# EAGLE board board_Nutzen (EAGLE 8.7.0)
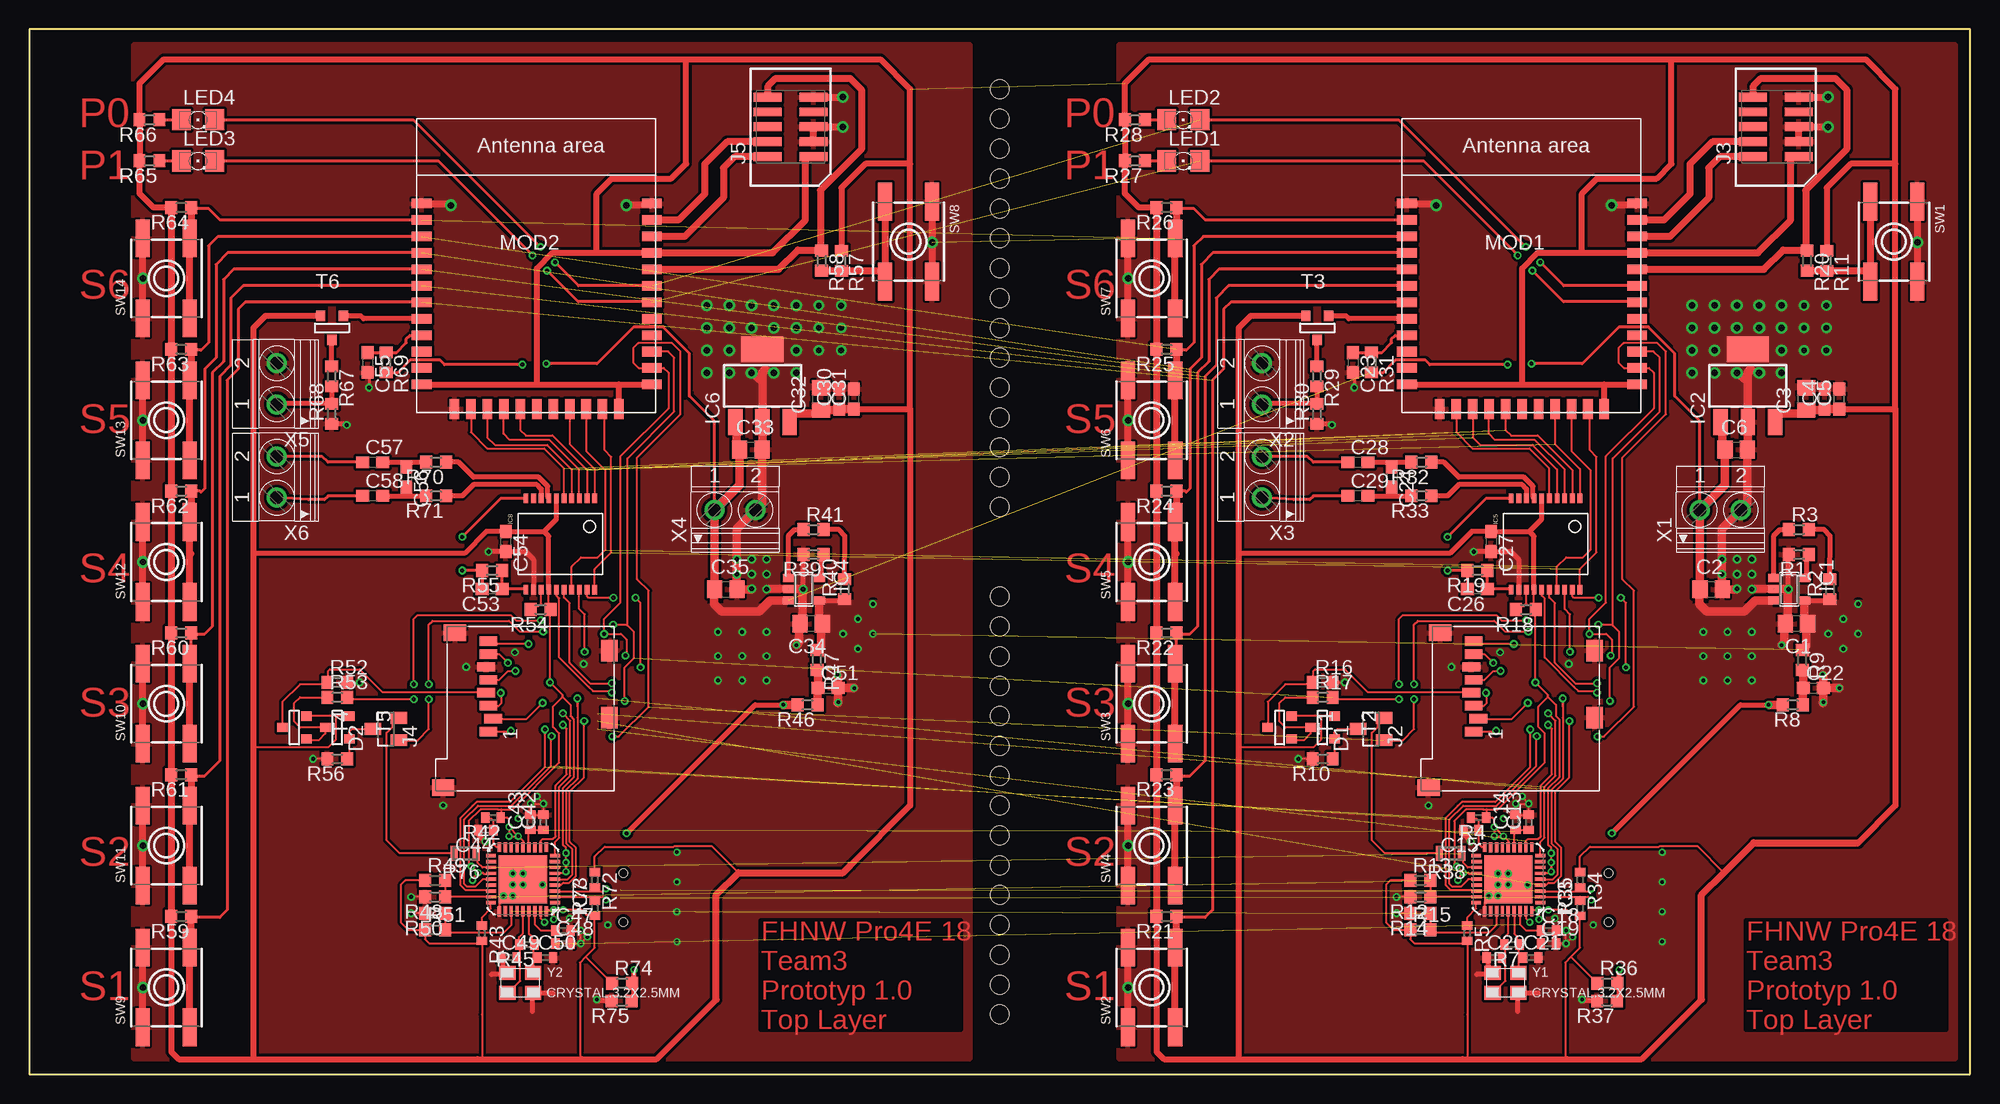
[diagram p6: board, top side]
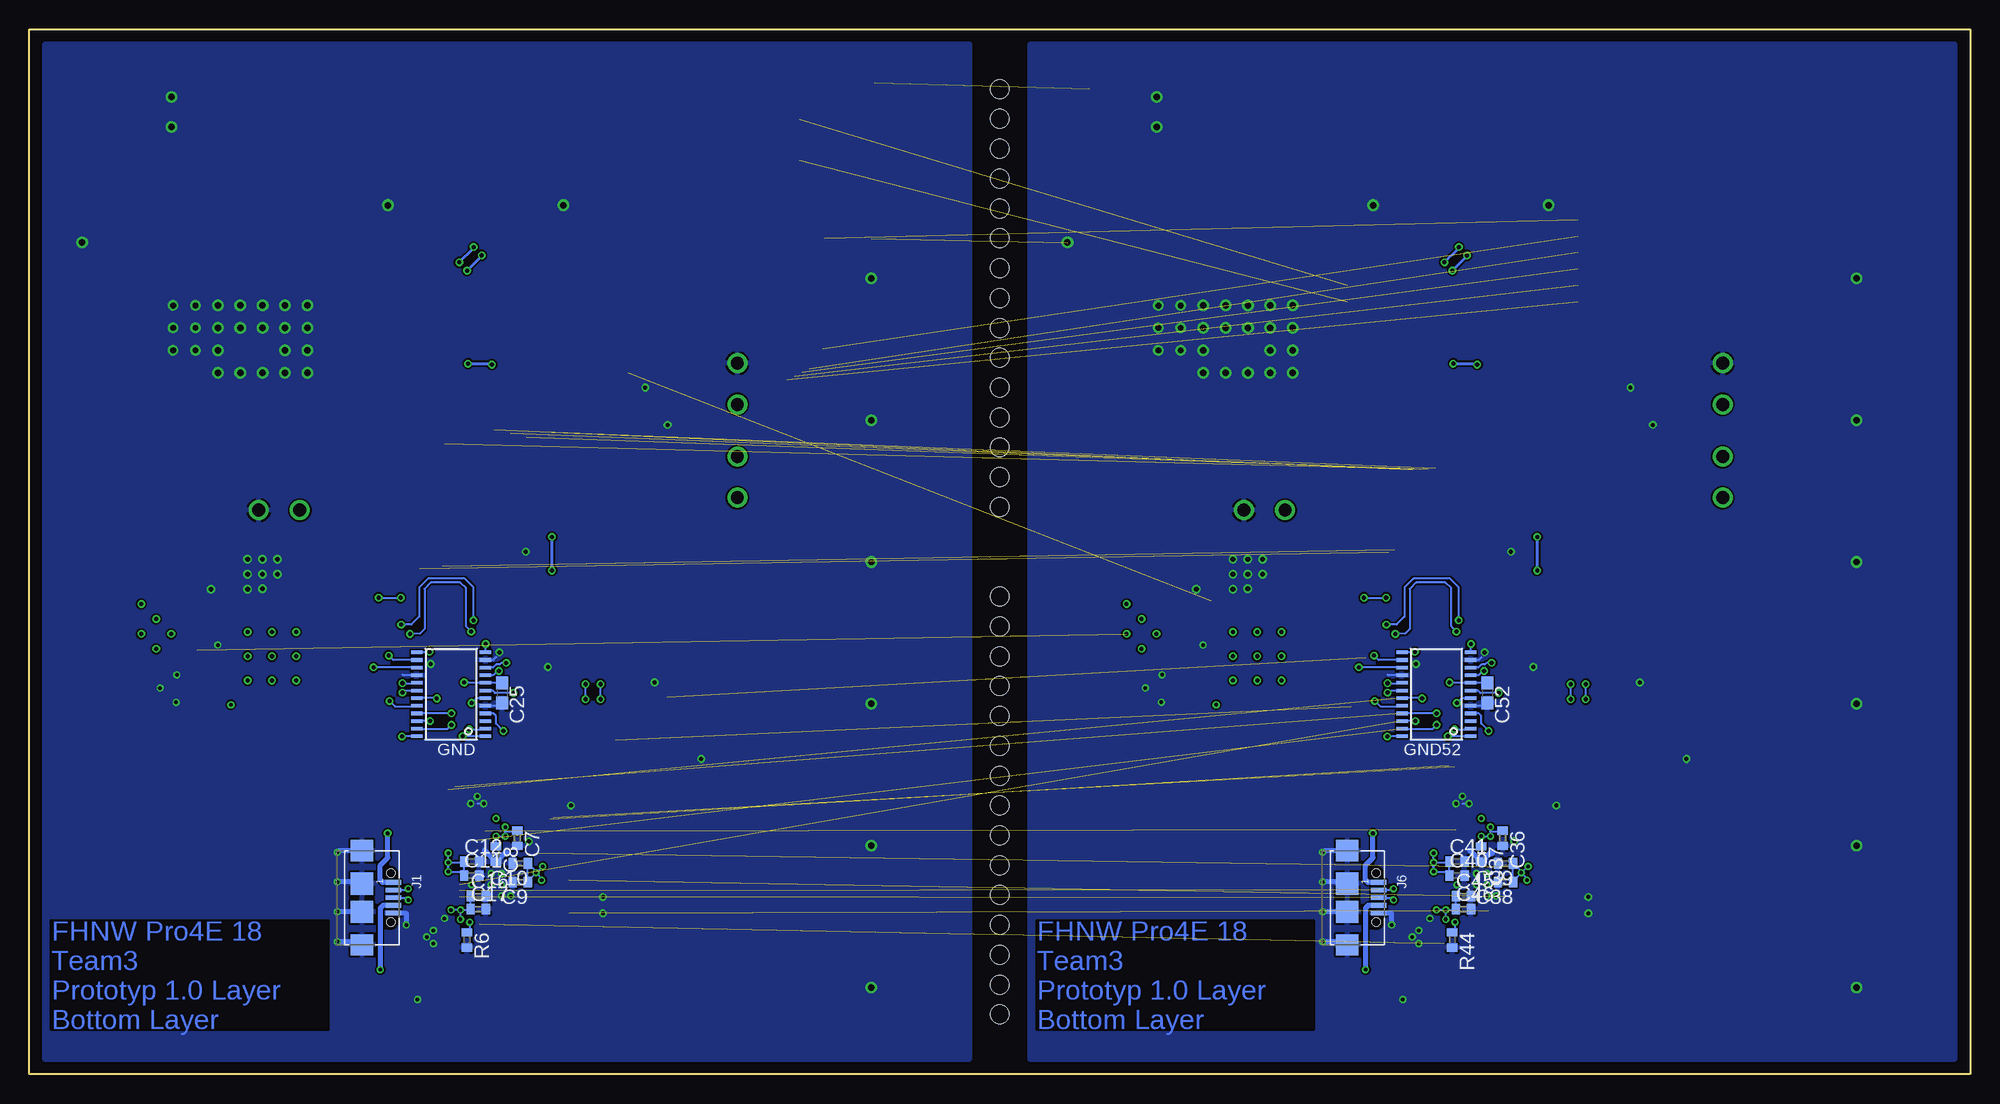
[diagram p7: board, bottom side, seen from below]

Size 165.1 x 88.9 mm. Coordinates in mm from the lower left corner, seen from the top.
Outline: 0,0 165.1,0 165.1,88.9 0,88.9 0,0
Copper layers (1*16): Top 0.035mm / dielectric 1.5mm / Bottom 0.035mm
Design rules "PCB-POOL Standard": minimum track width 0.15mm, minimum drill 0.3mm, track to track 0.15mm, track to pad 0.15mm, pad to pad 0.15mm, via to via 0.15mm, smd to smd 0.15mm, copper to edge 0.3mm, drill to drill 0.2mm, minimum pad ring 0.2mm, minimum via ring 0.15mm, stop-mask expansion 0.075mm, vias tented up to drill 0mil, thermal gap 0.2mm
Holes 1.6 mm at 82.55,5.08 82.55,7.62 82.55,10.16 82.55,12.7 82.55,15.24 82.55,17.78 82.55,20.32 82.55,22.86 82.55,25.4 82.55,27.94 82.55,30.48 82.55,33.02 82.55,35.56 82.55,38.1 82.55,40.64 82.55,50.8 82.55,53.34 82.55,55.88 82.55,58.42 82.55,60.96 82.55,63.5 82.55,66.04 82.55,68.58 82.55,71.12 82.55,73.66 82.55,76.2 82.55,78.74 82.55,81.28 82.55,83.82 82.55,48.26

## Footprints (pad centres in the part's own frame; a part is rotated, then mirrored left to right if it is on the bottom)
C0805 = smd 1.3 x 1.5: 1 -0.95,0; 2 0.95,0
C0603 = smd 1.1 x 1: 1 -0.85,0; 2 0.85,0
C0402 = smd 0.7 x 0.9: 1 -0.65,0; 2 0.65,0
SOT23 = smd 1 x 1.4: 1 -0.95,-1.1; 2 0.95,-1.1; 3 0,1.1
TSSOP24 = smd 0.305 x 0.991: 1 -3.575,-2.918; 2 -2.925,-2.918; 3 -2.275,-2.918; 4 -1.625,-2.918; 5 -0.975,-2.918; 6 -0.325,-2.918; 7 0.325,-2.918; 8 0.975,-2.918; 9 1.625,-2.918; 10 2.275,-2.918; 11 2.925,-2.918; 12 3.575,-2.918; 13 3.575,2.918; 14 2.925,2.918; 15 2.275,2.918; 16 1.625,2.918; 17 0.975,2.918; 18 0.325,2.918; 19 -0.325,2.918; 20 -0.975,2.918; 21 -1.625,2.918; 22 -2.275,2.918; 23 -2.925,2.918; 24 -3.575,2.918
SOT23-5 = smd 0.69 x 0.99: 1 -0.95,-1.29; 2 0,-1.29; 3 0.95,-1.29; 4 0.95,1.3; 5 -0.95,1.3
SOT223 = smd 1.219 x 2.235: 1 -2.311,-3.099; 2 0,-3.099; 3 2.311,-3.099 | smd 3.6 x 2.2: 4 0,3.099
QFN36-6X6 = smd 0.28 x 0.84: 1 -2,-2.735; 9 2,-2.735; 19 2,2.735; 27 -2,2.735 | smd 0.28 x 0.89: 2 -1.5,-2.71; 3 -1,-2.71; 4 -0.5,-2.71; 5 0,-2.71; 6 0.5,-2.71; 7 1,-2.71; 8 1.5,-2.71; 20 1.5,2.71; 21 1,2.71; 22 0.5,2.71; 23 0,2.71; 24 -0.5,2.71; 25 -1,2.71; 26 -1.5,2.71 | smd 0.84 x 0.28: 10 2.735,-2; 18 2.735,2; 28 -2.735,2; 36 -2.735,-2 | smd 0.89 x 0.28: 11 2.71,-1.5; 12 2.71,-1; 13 2.71,-0.5; 14 2.71,0; 15 2.71,0.5; 16 2.71,1; 17 2.71,1.5; 29 -2.71,1.5; 30 -2.71,1; 31 -2.71,0.5; 32 -2.71,0; 33 -2.71,-0.5; 34 -2.71,-1; 35 -2.71,-1.5 | smd 4.1 x 4.1: EXP 0,0
SSOP_20 = smd 0.813 x 0.406: 1 -3.9,2.925; 2 -3.9,2.275; 3 -3.9,1.625; 4 -3.9,0.975; 5 -3.9,0.325; 6 -3.9,-0.325; 7 -3.9,-0.975; 8 -3.9,-1.625; 9 -3.9,-2.275; 10 -3.9,-2.925; 11 3.9,-2.925; 12 3.9,-2.275; 13 3.9,-1.625; 14 3.9,-0.975; 15 3.9,-0.325; 16 3.9,0.325; 17 3.9,0.975; 18 3.9,1.625; 19 3.9,2.275; 20 3.9,2.925
629105136821 = smd 0.4 x 1.35: 1 -1.3,2.675; 2 -0.65,2.675; 3 0,2.675; 4 0.65,2.675; 5 1.3,2.675 | smd 1.8 x 1.9: SHELL -4,0; SHELL3 4,0 | smd 1.9 x 1.9: SHELL1 -1.2,0; SHELL2 1.2,0 | hole 0.7: -2.075,2.45; 2.075,2.45
693071010811 = smd 0.8 x 1.5: 1 0,0; 2 1.1,-0.4; 3 2.2,0; 4 3.3,0.2; 5 4.4,0; 6 5.5,0.2; 7 6.6,0; 8 7.7,0 | smd 1.4 x 1.9: 9 -4.75,3.85; 9-1 8.4,2.85 | smd 1.8 x 1.4: 10 1.19,-10.3; 10-1 6.89,-10.3
HDRV127P5X2-10_N = smd 0.76 x 2.4: 1 -2.54,-1.95; 2 -2.54,1.95; 3 -1.27,-1.95; 4 -1.27,1.95; 5 0,-1.95; 6 0,1.95; 7 1.27,-1.95; 8 1.27,1.95; 9 2.54,-1.95; 10 2.54,1.95
LED_1206 = smd 1.6 x 1.803: A -1.422,0; C 1.422,0
ACONNO_ACM_52832 = smd 1.676 x 0.813: 1 -9.8,8.4; 2 -9.8,7; 3 -9.8,5.6; 4 -9.8,4.2; 5 -9.8,2.8; 6 -9.8,1.4; 7 -9.8,0; 8 -9.8,-1.4; 9 -9.8,-2.8; 10 -9.8,-4.2; 11 -9.8,-5.6; 12 -9.8,-7; 24 9.8,-7; 25 9.8,-5.6; 26 9.8,-4.2; 27 9.8,-2.8; 28 9.8,-1.4; 29 9.8,0; 30 9.8,1.4; 31 9.8,2.8; 32 9.8,4.2; 33 9.8,5.6; 34 9.8,7; 35 9.8,8.4 | smd 0.813 x 1.676: 13 -7,-9.1; 14 -5.6,-9.1; 15 -4.2,-9.1; 16 -2.8,-9.1; 17 -1.4,-9.1; 18 0,-9.1; 19 1.4,-9.1; 20 2.8,-9.1; 21 4.2,-9.1; 22 5.6,-9.1; 23 7,-9.1
R0603 = smd 1 x 1.1: 1 -0.85,0; 2 0.85,0
R0402 = smd 0.7 x 0.9: 1 -0.65,0; 2 0.65,0
MINI_MELF-0102W = smd 0.6 x 1.3: 1 -0.95,0; 2 0.95,0
EVQ-Q2 = smd 3.2 x 1.2: A -3.4,-2; A' 3.4,-2; B -3.4,2; B' 3.4,2
SOT-23 = smd 0.787 x 0.889: 1 0.025,-1.016; 2 -0.94,1.016; 3 0.991,1.016
1751248 = drill 1.1 pad 1.7: 1 -1.75,-0.1; 2 1.75,-0.1
3.2X2.5MM = smd 1.4 x 1.2: 1 -1.1,-0.85; 2 1.1,-0.85; 3 1.1,0.85; 4 -1.1,0.85

## Placement (x,y rotation side)
C1  10u  [C0805]  150.33,38.32 180 top
C2  10u  [C0805]  143.07,41.26 0 top
C3  10u  [C0805]  151.16,57.46 90 top
C4  1u  [C0603]  152.72,57.46 90 top
C5  100n  [C0603]  153.96,57.46 90 top
C6  10u  [C0805]  145.19,53.14 0 top
C7  100n  [C0402]  123.59,20.08 270 bottom
C8  1n  [C0402]  125.41,18.73 270 bottom
C9  100n  [C0402]  123.35,16.35 180 bottom
C10  1n  [C0402]  123.35,17.94 180 bottom
C11  100n  [C0402]  127.48,16.91 0 bottom
C12  1n  [C0402]  127.48,18.1 0 bottom
C13  1u  [C0402]  127.56,21.43 90 top
C14  100n  [C0402]  126.44,21.43 90 top
C15  100n  [C0402]  122.63,20.76 180 top
C16  100n  [C0402]  126.92,15.16 0 bottom
C17  1n  [C0402]  126.92,14.05 0 bottom
C18  1u  [C0402]  129.22,12.22 0 top
C19  100n  [C0402]  129.22,11.11 0 top
C20  8p  [C0402]  124.62,9.92 0 top
C21  8p  [C0402]  127.71,9.92 0 top
C22  100n  [C0603]  151.76,32.86 0 top
C23  1u  [C0603]  112.6,60.57 270 top
C24  NP  [C0603]  115.89,50.8 270 top
C25  100n  [C0603]  124.89,32.43 270 bottom
C26  1n  [C0603]  123.19,41.27 180 top
C27  100n  [C0603]  124.35,45.33 270 top
C28  0R  [C0603]  113.03,52.07 0 top
C29  0R  [C0603]  113.03,49.21 0 top
C30  1u  [C0603]  68.9,57.46 90 top
C31  100n  [C0603]  70.14,57.46 90 top
C32  10u  [C0805]  67.34,57.46 90 top
C33  10u  [C0805]  61.37,53.14 0 top
C34  10u  [C0805]  66.51,38.32 180 top
C35  10u  [C0805]  59.25,41.26 0 top
C36  100n  [C0402]  39.77,20.08 270 bottom
C37  1n  [C0402]  41.59,18.73 270 bottom
C38  100n  [C0402]  39.53,16.35 180 bottom
C39  1n  [C0402]  39.53,17.94 180 bottom
C40  100n  [C0402]  43.66,16.91 0 bottom
C41  1n  [C0402]  43.66,18.1 0 bottom
C42  1u  [C0402]  43.74,21.43 90 top
C43  100n  [C0402]  42.62,21.43 90 top
C44  100n  [C0402]  38.81,20.76 180 top
C45  100n  [C0402]  43.1,15.16 0 bottom
C46  1n  [C0402]  43.1,14.05 0 bottom
C47  1u  [C0402]  45.4,12.22 0 top
C48  100n  [C0402]  45.4,11.11 0 top
C49  8p  [C0402]  40.8,9.92 0 top
C50  8p  [C0402]  43.89,9.92 0 top
C51  100n  [C0603]  67.94,32.86 0 top
C52  100n  [C0603]  41.07,32.43 270 bottom
C53  1n  [C0603]  39.37,41.27 180 top
C54  100n  [C0603]  40.53,45.33 270 top
C55  1u  [C0603]  28.78,60.57 270 top
C56  NP  [C0603]  32.07,50.8 270 top
C57  0R  [C0603]  29.21,52.07 0 top
C58  0R  [C0603]  29.21,49.21 0 top
D1  BAS40-05  [SOT23]  114.14,29.37 90 top
D2  BAS40-05  [SOT23]  30.32,29.37 90 top
GND  TS3A27  [TSSOP24]  129.22,32.32 90 bottom
GND52  TS3A27  [TSSOP24]  45.4,32.32 90 bottom
IC1  MCP73831  [SOT23-5]  149.71,41.27 270 top
IC2  LT1963EST-1.5  [SOT223]  146.18,58.58 0 top
IC3  VUB300  [QFN36-6X6]  125.81,16.59 90 top
IC4  MCP73831  [SOT23-5]  65.89,41.27 270 top
IC5  WTV020SD-20S  [SSOP_20]  128.98,45.1 270 top
IC6  LT1963EST-1.5  [SOT223]  62.36,58.58 0 top
IC7  VUB300  [QFN36-6X6]  41.99,16.59 90 top
IC8  WTV020SD-20S  [SSOP_20]  45.16,45.1 270 top
J1  [629105136821]  136.81,15.02 270 bottom
J2  [693071010811]  122.87,29.15 90 top
J3  DEBUG_CONNECTOR  [HDRV127P5X2-10_N]  148.57,80.61 90 top
J4  [693071010811]  39.05,29.15 90 top
J5  DEBUG_CONNECTOR  [HDRV127P5X2-10_N]  64.75,80.61 90 top
J6  [629105136821]  52.99,15.02 270 bottom
LED1  [LED_1206]  98.17,77.71 0 top
LED2  [LED_1206]  98.17,81.2 0 top
LED3  [LED_1206]  14.35,77.71 0 top
LED4  [LED_1206]  14.35,81.2 0 top
MOD1  ACM_52832_VER2  [ACONNO_ACM_52832]  126.98,65.68 0 top
MOD2  ACM_52832_VER2  [ACONNO_ACM_52832]  43.16,65.68 0 top
R1  2k  [R0603]  150.53,44.22 180 top
R2  NP  [R0603]  153.18,41.26 90 top
R3  NP  [R0603]  150.53,46.33 0 top
R4  100k  [R0402]  123.27,21.83 180 top
R5  NP  [R0402]  122.32,11.99 270 top
R6  12k  [R0402]  127.87,11.43 270 bottom
R7  1M  [R0402]  126.13,11.03 180 top
R8  Ferit Bead  [R0603]  150.02,31.43 180 top
R9  Ferit Bead  [R0603]  150.81,35.24 270 top
R10  470k  [R0603]  110.01,26.83 180 top
R11  10k  [R0603]  152.9,69.2 270 top
R12  1k  [R0603]  118.33,15.08 180 top
R13  NP  [R0603]  118.33,16.48 0 top
R14  1k  [R0603]  118.33,13.68 180 top
R15  NP  [R0603]  118.33,12.29 0 top
R16  470k  [R0603]  110.01,33.34 0 top
R17  470k  [R0603]  110.01,32.07 0 top
R18  150  [R0603]  127.32,39.53 180 top
R19  15k  [R0603]  123.19,42.86 180 top
R20  330R  [R0603]  151.23,69.22 270 top
R21  10k  [R0603]  96.74,13.42 180 top
R22  10k  [R0603]  96.74,37.55 180 top
R23  10k  [R0603]  96.74,25.48 180 top
R24  10k  [R0603]  96.74,49.61 180 top
R25  10k  [R0603]  96.74,61.68 180 top
R26  10k  [R0603]  96.74,73.74 180 top
R27  1k  [R0603]  94.04,77.71 180 top
R28  1k  [R0603]  94.04,81.2 180 top
R29  0R  [R0603]  109.54,59.37 270 top
R30  NP  [R0603]  109.54,56.2 90 top
R31  1k  [R0603]  114.19,60.57 270 top
R32  0R  [R0603]  118.43,52.07 180 top
R33  0R  [R0603]  118.43,49.21 180 top
R34  15k  [R0402]  131.92,16.54 270 top
R35  15k  [R0402]  131.92,14.13 90 top
R36  NP  [R0603]  134.24,7.75 0 top
R37  1k  [R0603]  134.21,6.22 180 top
R38  0R  [MINI_MELF-0102W]  120.89,18.8 180 top
R39  2k  [R0603]  66.71,44.22 180 top
R40  NP  [R0603]  69.36,41.26 90 top
R41  NP  [R0603]  66.71,46.33 0 top
R42  100k  [R0402]  39.45,21.83 180 top
R43  NP  [R0402]  38.5,11.99 270 top
R44  12k  [R0402]  44.05,11.43 270 bottom
R45  1M  [R0402]  42.31,11.03 180 top
R46  Ferit Bead  [R0603]  66.2,31.43 180 top
R47  Ferit Bead  [R0603]  66.99,35.24 270 top
R48  1k  [R0603]  34.51,15.08 180 top
R49  NP  [R0603]  34.51,16.48 0 top
R50  1k  [R0603]  34.51,13.68 180 top
R51  NP  [R0603]  34.51,12.29 0 top
R52  470k  [R0603]  26.19,33.34 0 top
R53  470k  [R0603]  26.19,32.07 0 top
R54  150  [R0603]  43.5,39.53 180 top
R55  15k  [R0603]  39.37,42.86 180 top
R56  470k  [R0603]  26.19,26.83 180 top
R57  10k  [R0603]  69.08,69.2 270 top
R58  330R  [R0603]  67.41,69.22 270 top
R59  10k  [R0603]  12.92,13.42 180 top
R60  10k  [R0603]  12.92,37.55 180 top
R61  10k  [R0603]  12.92,25.48 180 top
R62  10k  [R0603]  12.92,49.61 180 top
R63  10k  [R0603]  12.92,61.68 180 top
R64  10k  [R0603]  12.92,73.74 180 top
R65  1k  [R0603]  10.22,77.71 180 top
R66  1k  [R0603]  10.22,81.2 180 top
R67  0R  [R0603]  25.72,59.37 270 top
R68  NP  [R0603]  25.72,56.2 90 top
R69  1k  [R0603]  30.37,60.57 270 top
R70  0R  [R0603]  34.61,52.07 180 top
R71  0R  [R0603]  34.61,49.21 180 top
R72  15k  [R0402]  48.1,16.54 270 top
R73  15k  [R0402]  48.1,14.13 90 top
R74  NP  [R0603]  50.42,7.75 0 top
R75  1k  [R0603]  50.39,6.22 180 top
R76  0R  [MINI_MELF-0102W]  37.07,18.8 180 top
SW1  SW_TACT_SMD  [EVQ-Q2]  158.61,70.84 270 top
SW2  SW_TACT_SMD  [EVQ-Q2]  95.47,7.39 90 top
SW3  SW_TACT_SMD  [EVQ-Q2]  95.47,31.52 90 top
SW4  SW_TACT_SMD  [EVQ-Q2]  95.47,19.45 90 top
SW5  SW_TACT_SMD  [EVQ-Q2]  95.47,43.58 90 top
SW6  SW_TACT_SMD  [EVQ-Q2]  95.47,55.65 90 top
SW7  SW_TACT_SMD  [EVQ-Q2]  95.47,67.71 90 top
SW8  SW_TACT_SMD  [EVQ-Q2]  74.79,70.84 270 top
SW9  SW_TACT_SMD  [EVQ-Q2]  11.65,7.39 90 top
SW10  SW_TACT_SMD  [EVQ-Q2]  11.65,31.52 90 top
SW11  SW_TACT_SMD  [EVQ-Q2]  11.65,19.45 90 top
SW12  SW_TACT_SMD  [EVQ-Q2]  11.65,43.58 90 top
SW13  SW_TACT_SMD  [EVQ-Q2]  11.65,55.65 90 top
SW14  SW_TACT_SMD  [EVQ-Q2]  11.65,67.71 90 top
T1  [SOT-23]  106.36,29.53 270 top
T2  [SOT-23]  110.01,29.53 270 top
T3  [SOT-23]  109.54,63.5 0 top
T4  [SOT-23]  22.54,29.53 270 top
T5  [SOT-23]  26.19,29.53 270 top
T6  [SOT-23]  25.72,63.5 0 top
X1  1751248  [1751248]  143.84,48.09 0 top
X2  1751248  [1751248]  104.78,58.74 90 top
X3  1751248  [1751248]  104.78,50.8 90 top
X4  1751248  [1751248]  60.02,48.09 0 top
X5  1751248  [1751248]  20.95,58.74 90 top
X6  1751248  [1751248]  20.95,50.8 90 top
Y1  CRYSTAL.3.2X2.5MM  [3.2X2.5MM]  125.57,7.78 0 top
Y2  CRYSTAL.3.2X2.5MM  [3.2X2.5MM]  41.75,7.78 0 top

## Tracks (layer width: path | path; a pad name or v marks a point on that pad's centre or on a via)
+3V3  (via drill 0.3, 0.35)  (1 unrouted)
  Top 0.15: R5.2 122.32,11.14 122.32,5.08 | 130.78,13.97 v129.22,13.97 | v121.42,17.68 121.21,17.89 121.21,21.51 | 123.67,22.54 122.4,22.54 | 123.75,22 R4.1 | R43.2 38.5,11.14 38.5,5.08 | 46.96,13.97 v45.4,13.97 | v37.6,17.68 37.39,17.89 37.39,21.51 | 39.85,22.54 38.58,22.54 | 39.93,22 R42.1
  Top 0.152: v129.22,13.97 v128.43,13.97 | v128.43,13.97 v128.43,13.18 | IC3.36 127.81,13.97 v128.43,13.97 | v129.46,17.22 v129.46,18.81 129.46,19.26 129.19,19.53 129.19,24.32 130.14,25.26 130.14,30.2 129.86,30.47 129.86,31.43 129.19,32.1 | v129.46,18.02 v129.46,17.22 | v129.46,17.22 129.33,17.09 IC3.6 | v124.62,21.03 v125.41,20.24 | v125.41,20.24 v124.62,20.24 v124.62,21.03 | v125.41,20.24 125.81,19.84 IC3.14 | v122,17.14 121.52,16.67 v121.52,16.51 | v121.42,17.68 v121.42,17.67 v122,17.14 | v122,17.14 122.4,17.14 122.48,17.07 123.08,17.07 IC3.22 | v124.62,21.03 124.62,21.67 124.46,21.83 R4.1 123.98,21.89 123.98,22.54 | 123.67,22.54 123.98,22.54 | 123.98,22.54 124.94,22.54 128.91,26.51 128.91,29.01 128.37,29.54 128.37,31.28 129.19,32.1 | 122.4,22.54 122.24,22.54 122.2,22.5 122.18,22.5 121.21,21.53 121.21,21.51 | R13.1 115.79,16.48 115.41,16.1 115.41,12.92 116.05,12.29 R15.1 117.48,11.49 117.82,11.14 122.32,11.14 | 131.14,9.98 130.65,9.49 130.65,1.43 130.81,1.27 | 131.14,9.98 131.92,10.76 R35.1 131.86,13.54 131.21,13.54 130.78,13.97 | R36.1 131.15,9.98 131.14,9.98 | 128.66,47.22 128.66,47.31 | IC5.14 128.01,39.69 R18.1 128.11,39.47 v128.11,33.34 129.19,32.26 129.19,32.1 | R34.1 131.92,18.52 132.76,19.36 138.63,19.36 138.69,19.42 141.87,19.42 144.15,17.14 | 122.32,5.08 122.32,1.27 121.92,1.27 | T2.2 109.86,30.47 | 109.86,30.47 T1.2 | 109.86,30.47 109.86,28.45 109.22,27.81 102.87,27.81 | v45.4,13.97 v44.61,13.97 | v44.61,13.97 v44.61,13.18 | IC7.36 43.99,13.97 v44.61,13.97 | v45.64,17.22 v45.64,18.81 45.64,19.26 45.37,19.53 45.37,24.32 46.32,25.26 46.32,30.2 46.04,30.47 46.04,31.43 45.37,32.1
  Top 0.152: v45.64,18.02 v45.64,17.22 | v45.64,17.22 45.51,17.09 IC7.6 | v40.8,21.03 v41.59,20.24 | v41.59,20.24 v40.8,20.24 v40.8,21.03 | v41.59,20.24 41.99,19.84 IC7.14 | v38.18,17.14 37.7,16.67 v37.7,16.51 | v37.6,17.68 v37.6,17.67 v38.18,17.14 | v38.18,17.14 38.58,17.14 38.66,17.07 39.26,17.07 IC7.22 | v40.8,21.03 40.8,21.67 40.64,21.83 R42.1 40.16,21.89 40.16,22.54 | 39.85,22.54 40.16,22.54 | 40.16,22.54 41.12,22.54 45.09,26.51 45.09,29.01 44.55,29.54 44.55,31.28 45.37,32.1 | 38.58,22.54 38.42,22.54 38.38,22.5 38.36,22.5 37.39,21.53 37.39,21.51 | R49.1 31.97,16.48 31.59,16.1 31.59,12.92 32.23,12.29 R51.1 33.66,11.49 34,11.14 38.5,11.14 | 47.32,9.98 46.83,9.49 46.83,1.43 46.99,1.27 | 47.32,9.98 48.1,10.76 R73.1 48.04,13.54 47.39,13.54 46.96,13.97 | R74.1 47.33,9.98 47.32,9.98 | 44.84,47.22 44.84,47.31 | IC8.14 44.19,39.69 R54.1 44.29,39.47 v44.29,33.34 45.37,32.26 45.37,32.1 | R72.1 48.1,18.52 48.94,19.36 54.81,19.36 54.87,19.42 58.05,19.42 60.33,17.14 | 38.5,5.08 38.5,1.27 38.1,1.27 | T5.2 26.04,30.47 | 26.04,30.47 T4.2 | 26.04,30.47 26.04,28.45 25.4,27.81 19.05,27.81
  Top 0.406: 127.61,46.18 C27.1 122.69,46.18 120.84,44.32 102.87,44.32 | 127.61,46.18 128.66,47.22 | 128.66,47.31 IC5.6 | IC5.14 128.01,45.78 127.61,46.18 | 43.8,46.18 C54.1 38.87,46.18 37.02,44.32 19.05,44.32 | 43.8,46.18 44.84,47.22 | 44.84,47.31 IC8.6 | IC8.14 44.19,45.78 43.8,46.18
  Top 0.508: R26.2 94.38,73.74 93.19,74.93 R27.2 R28.2 93.19,84.3 95.25,86.36 139.7,86.36 | T3.2 103.89,64.52 102.87,63.5 102.87,44.32 102.87,27.81 102.87,1.27 | 102.87,1.27 96.52,1.27 95.89,1.9 R21.2 | 102.87,1.27 121.92,1.27 130.81,1.27 137.16,1.27 142.24,6.35 | 158.75,56.61 158.75,22.86 155.57,19.68 | C5.1 158.75,56.61 | MOD1.12 127,58.68 | 127,58.68 133.98,58.68 | 133.98,58.68 MOD1.24 | MOD1.23 133.98,58.68 | 127,58.68 127,68.58 128.3,69.88 132.08,69.88 | 132.08,69.88 MOD1.32 | 158.75,56.61 158.75,77.47 | 158.75,77.47 154.94,77.47 152.9,75.43 R11.1 | 132.08,69.88 132.08,74.93 133.35,76.2 138.43,76.2 139.7,77.47 139.7,86.36 | 139.7,86.36 156.21,86.36 158.75,83.82 158.75,77.47 | R64.2 10.56,73.74 9.37,74.93 R65.2 R66.2 9.37,84.3 11.43,86.36 55.88,86.36 | T6.2 20.07,64.52 19.05,63.5 19.05,44.32 19.05,27.81 19.05,1.27 | 19.05,1.27 12.7,1.27 12.07,1.9 R59.2 | 19.05,1.27 38.1,1.27 46.99,1.27 53.34,1.27 58.42,6.35 | 74.93,56.61 74.93,22.86 69.85,17.78 | C31.1 74.93,56.61 | MOD2.12 43.18,58.68 | 43.18,58.68 50.16,58.68 | 50.16,58.68 MOD2.24 | MOD2.23 50.16,58.68 | 43.18,58.68 43.18,68.58 44.48,69.88 48.26,69.88 | 48.26,69.88 MOD2.32 | 74.93,56.61 74.93,77.47 | 74.93,77.47 71.12,77.47 69.08,75.43 R57.1 | 48.26,69.88 48.26,74.93 49.53,76.2 54.61,76.2 55.88,77.47 55.88,86.36 | 55.88,86.36 72.39,86.36 74.93,83.82 74.93,77.47
  Top 0.61: MOD1.32 147.06,69.88 149.84,72.67 149.84,78.07 J3.1 | R26.2 R25.2 R24.2 R22.2 R23.2 R21.2 | MOD2.32 63.24,69.88 66.02,72.67 66.02,78.07 J5.1 | R64.2 R63.2 R62.2 R60.2 R61.2 R59.2 | 58.42,6.35 58.42,15.24 60.33,17.14 69.22,17.14 69.85,17.78 | 155.57,19.68 146.69,19.68 144.15,17.14 142.24,15.24 142.24,6.35
  Top 0.711: 148.73,55.24 arc-90 IC2.3 148.5,56.2 151.16,56.2 C3.1 152.72,56.51 C4.1 C5.1 | 64.91,55.24 arc-90 IC6.3 64.67,56.2 67.34,56.2 C32.1 68.9,56.51 C30.1 C31.1
  Bottom 0.152: v122,17.14 C9.1 C10.1 122,17.24 v122,17.14 | 121.96,17.11 121.52,16.67 v121.52,16.51 | 121.96,17.11 v122,17.14 | v121.42,17.68 v121.42,17.67 v122,17.14 | 121.92,17.14 121.96,17.11 | C8.1 v125.41,20.24 v124.62,20.24 | C7.1 123.68,20.64 124.62,20.64 v124.62,20.24 | v129.46,17.22 v129.46,18.02 128.21,18.02 | v129.46,17.22 v129.46,18.81 | 128.21,18.02 C12.1 | v129.46,17.22 128.44,17.22 C11.1 128.13,17.94 128.21,18.02 | v128.43,13.97 127.65,13.97 C17.1 C16.1 | v124.62,20.24 v124.62,21.03 | v128.43,13.18 v128.43,13.97 | v128.43,13.97 v129.22,13.97 | C25.1 126.29,33.28 GND.8 126.35,33.34 v128.11,33.34 | v38.18,17.14 C38.1 C39.1 38.18,17.24 v38.18,17.14 | 38.14,17.11 37.7,16.67 v37.7,16.51 | 38.14,17.11 v38.18,17.14 | v37.6,17.68 v37.6,17.67 v38.18,17.14 | 38.1,17.14 38.14,17.11 | C37.1 v41.59,20.24 v40.8,20.24 | C36.1 39.86,20.64 40.8,20.64 v40.8,20.24 | v45.64,17.22 v45.64,18.02 44.39,18.02 | v45.64,17.22 v45.64,18.81 | 44.39,18.02 C41.1 | v45.64,17.22 44.62,17.22 C40.1 44.31,17.94 44.39,18.02 | v44.61,13.97 43.83,13.97 C46.1 C45.1 | v40.8,20.24 v40.8,21.03 | v44.61,13.18 v44.61,13.97 | v44.61,13.97 v45.4,13.97 | C52.1 42.47,33.28 GND52.8 42.53,33.34 v44.29,33.34
+5V  (via drill 0.35)  (1 unrouted)
  Top 0.406: IC1.4 153.02,40.32 R2.1 | IC4.4 69.2,40.32 R40.1
  Top 0.711: IC1.4 151.01,38.72 C1.1 151.16,38.72 151.16,36.44 R9.1 | IC4.4 67.19,38.72 C34.1 67.33,38.72 67.33,36.44 R47.1
  other vias: 155.57,40.01 154.31,38.73 153.03,37.47 155.57,37.47 154.31,36.2 71.75,40.01 70.48,38.73 69.22,37.47 71.75,37.47 70.48,36.2
  pour Top (no thermals): 151.29,35.56 151.29,40.32 156.21,40.32 156.21,35.56
  pour Top (no thermals): 67.47,35.56 67.47,40.32 72.39,40.32 72.39,35.56
/EN  (via drill 0.35)  (1 unrouted)
  Top 0.152: R17.2 111.02,31.91 v116.52,31.91 | v116.52,33.18 116.52,38.73 116.84,39.05 124.78,39.05 125.22,38.61 v127.32,38.61 | v133.48,38.26 134.62,38.26 134.7,38.18 | 134.7,38.18 135.25,37.62 135.25,35.41 134.46,34.62 v134.46,31.75 | 134.7,38.18 134.7,52.4 138.68,56.39 138.68,60.96 138.16,61.48 MOD1.26 | R53.2 27.2,31.91 v32.7,31.91 | v32.7,33.18 32.7,38.73 33.02,39.05 40.96,39.05 41.4,38.61 v43.5,38.61 | v49.66,38.26 50.8,38.26 50.88,38.18 | 50.88,38.18 51.44,37.62 51.44,35.41 50.64,34.62 v50.64,31.75 | 50.88,38.18 50.88,52.4 54.86,56.39 54.86,60.96 54.34,61.48 MOD2.26
  Bottom 0.152: v116.52,31.91 v116.52,33.18 | v133.48,38.26 132.61,38.26 131.93,38.95 131.93,41.4 131.17,42.16 128.07,42.16 127.32,41.41 v127.32,38.61 | v134.46,31.75 133.99,31.27 132.21,31.27 GND.20 | v32.7,31.91 v32.7,33.18 | v49.66,38.26 48.79,38.26 48.11,38.95 48.11,41.4 47.35,42.16 44.25,42.16 43.5,41.41 v43.5,38.61 | v50.64,31.75 50.16,31.27 48.39,31.27 GND52.20
BUSY  (1 unrouted)
  Top 0.152: MOD1.15 122.78,54.18 123.42,53.54 127.87,53.54 129.96,51.45 IC5.4 | MOD2.15 38.96,54.18 39.6,53.54 44.05,53.54 46.14,51.45 IC8.4
CLK  (via drill 0.35)  (1 unrouted)
  Top 0.152: IC3.9 128.54,19.77 128.89,20.11 128.89,24.44 129.84,25.39 129.84,30.07 v129.2,30.7 | IC7.9 44.72,19.77 45.07,20.11 45.07,24.44 46.02,25.39 46.02,30.07 v45.38,30.7
  Bottom 0.152: v129.2,30.7 129.76,30.7 GND.21 | v45.38,30.7 45.94,30.7 GND52.21
CMD  (via drill 0.35)  (1 unrouted)
  Top 0.152: IC3.11 127.32,19.84 127.48,20 128.35,20 128.59,20.24 128.59,24.57 129.53,25.51 129.53,29.38 v129.2,29.71 | IC7.11 43.5,19.84 43.66,20 44.53,20 44.77,20.24 44.77,24.57 45.71,25.51 45.71,29.38 v45.38,29.71
  Bottom 0.152: v129.2,29.71 129.52,29.4 GND.23 | v45.38,29.71 45.7,29.4 GND52.23
D0  (via drill 0.35)  (1 unrouted)
  Top 0.152: IC3.5 129.62,16.59 130.02,16.99 130.02,19.13 129.5,19.65 129.5,24.19 130.44,25.14 130.44,30.32 v130.44,31.97 130.44,31.28 | IC7.5 45.8,16.59 46.2,16.99 46.2,19.13 45.67,19.65 45.67,24.19 46.62,25.14 46.62,30.32 v46.62,31.97 46.62,31.28
  Bottom 0.152: v130.44,31.97 130.47,32 GND.19 | v46.62,31.97 46.65,32 GND52.19
D1  (via drill 0.35)  (1 unrouted)
  Top 0.152: IC3.4 129.04,16.09 129.24,16.29 129.75,16.29 130.32,16.86 130.32,19.25 129.8,19.78 129.8,24.07 130.99,25.26 130.99,29.79 | 130.99,29.79 v131.01,30.04 arc90 130.99,30.02 130.99,29.79 | IC7.4 45.22,16.09 45.42,16.29 45.92,16.29 46.5,16.86 46.5,19.25 45.98,19.78 45.98,24.07 47.17,25.26 47.17,29.79 | 47.17,29.79 v47.2,30.04 arc90 47.17,30.02 47.17,29.79
  Bottom 0.152: v131.01,30.04 131.22,30.05 GND.22 | v47.2,30.04 47.4,30.05 GND52.22
D2  (via drill 0.35)  (1 unrouted)
  Top 0.152: 121.52,22.81 121.52,22.86 | 121.52,22.81 120.51,21.8 120.51,16.07 120.92,15.65 123.04,15.65 IC3.25 | 121.52,22.81 121.87,23.16 124.7,23.16 127.68,26.14 v127.68,29.33 | 37.7,22.81 37.7,22.86 | 37.7,22.81 36.69,21.8 36.69,16.07 37.1,15.65 39.22,15.65 IC7.25 | 37.7,22.81 38.05,23.16 40.88,23.16 43.86,26.14 v43.86,29.33
  Bottom 0.152: v127.68,29.33 126.37,29.33 GND.2 | v43.86,29.33 42.55,29.33 GND52.2
D3  (via drill 0.35)  (1 unrouted)
  Top 0.152: IC3.23 122.4,16.59 121.76,15.95 121.05,15.95 120.81,16.19 120.81,21.67 121.98,22.84 124.81,22.84 128.19,26.22 128.19,28.7 128.31,28.7 128.31,28.77 | IC7.23 38.58,16.59 37.94,15.95 37.23,15.95 36.99,16.19 36.99,21.67 38.16,22.84 40.99,22.84 44.37,26.22 44.37,28.7 44.49,28.7 44.49,28.77
  Top 0.254: v128.25,28.77 128.31,28.7 | v44.42,28.77 44.49,28.7
  Bottom 0.152: GND.1 128.23,28.75 v128.25,28.77 | GND52.1 44.41,28.75 v44.42,28.77
D+  (via drill 0.3)  (1 unrouted)
  Top 0.15: IC3.2 131.92,15.09 | 131.92,15.09 132.61,15.09 v132.87,14.83 | R35.2 131.92,15.09 | IC7.2 48.1,15.09 | 48.1,15.09 48.79,15.09 v49.05,14.83 | R73.2 48.1,15.09
  Top 0.152: IC3.2 arc90 IC3.2 | IC7.2 arc90 IC7.2
  Bottom 0.15: J1.3 133.06,15.02 v132.87,14.83 | J6.3 49.24,15.02 v49.05,14.83
D-  (via drill 0.3)  (1 unrouted)
  Top 0.15: 128.55,15.56 131.99,15.56 | 131.99,15.56 132.65,15.56 v132.87,15.78 | R34.2 131.99,15.83 131.99,15.56 | 44.73,15.56 48.16,15.56 | 48.16,15.56 48.83,15.56 v49.05,15.78 | R72.2 48.16,15.83 48.16,15.56
  Top 0.152: IC3.3 arc90 128.55,15.56 | IC7.3 arc90 44.73,15.56
  Bottom 0.15: J1.2 132.99,15.67 v132.87,15.78 | J6.2 49.17,15.67 v49.05,15.78
DCLK  (1 unrouted)
  Top 0.152: MOD1.17 125.58,54.81 126.06,54.33 128.29,54.33 128.32,54.36 131.26,51.42 IC5.2 | MOD2.17 41.76,54.81 42.24,54.33 44.48,54.33 44.5,54.36 47.44,51.42 IC8.2
DIN  (1 unrouted)
  Top 0.152: IC5.3 130.61,51.44 128.07,53.98 124.69,53.98 124.16,54.51 124.18,54.53 MOD1.16 | IC8.3 46.79,51.44 44.25,53.98 40.87,53.98 40.34,54.51 40.36,54.53 MOD2.16
GND  (via drill 0.3, 0.35, 0.4, 0.5, 0.55)  (1 unrouted)
  Top 0.152: v126.44,23.02 C14.2 C13.2 v127.56,23.02 | 127,23.57 v127,23.65 | v126.44,23.02 127,23.57 | v127.56,23.02 127,23.57 | v130.73,11.11 v130.73,12.22 | v130.73,12.22 C18.2 C19.2 v130.73,11.11 | v130.73,11.11 v131.29,11.67 v130.73,12.22 | v126.44,23.02 v127.56,23.02 | IC3.28 123.81,14.59 124.14,14.92 v124.14,15.16 | R12.2 v116.3,15.08 | R14.2 v116.3,13.68 | 126.68,43.81 126.71,43.79 | R10.2 v107.95,26.83 | R16.2 v111.92,33.34 | v42.62,23.02 C43.2 C42.2 v43.74,23.02 | 43.18,23.57 v43.18,23.65 | v42.62,23.02 43.18,23.57 | v43.74,23.02 43.18,23.57 | v46.91,11.11 v46.91,12.22 | v46.91,12.22 C47.2 C48.2 v46.91,11.11 | v46.91,11.11 v47.47,11.67 v46.91,12.22 | v42.62,23.02 v43.74,23.02 | IC7.28 39.99,14.59 40.32,14.92 v40.32,15.16 | R48.2 v32.48,15.08 | R50.2 v32.48,13.68 | 42.86,43.81 42.89,43.79 | R56.2 v24.13,26.83 | R52.2 v28.1,33.34 | 38.16,20.43 C44.2
  Top 0.254: C23.2 112.71,59.6 v112.71,58.42 | C55.2 28.89,59.6 v28.89,58.42
  Top 0.406: R1.2 149.6,43.74 149.6,41.27 | 126.6,5.32 126.6,6.91 128.35,6.91 | 124.54,8.49 124.06,8.49 | 124.06,8.49 123.11,8.49 | 123.9,9.76 124.06,9.76 124.06,8.49 | R37.2 132.21,6.22 v132.08,6.35 | 126.68,43.81 126.02,44.48 C27.2 122.9,44.48 v122.87,44.45 | 126.71,43.79 IC5.12 | R30.1 110.7,55.35 v110.81,55.24 | R39.2 65.78,43.74 65.78,41.27 | 42.78,5.32 42.78,6.91 44.53,6.91 | 40.72,8.49 40.24,8.49 | 40.24,8.49 39.29,8.49 | 40.08,9.76 40.24,9.76 40.24,8.49 | R75.2 48.39,6.22 v48.26,6.35 | 42.86,43.81 42.2,44.48 C54.2 39.08,44.48 v39.05,44.45 | 42.89,43.79 IC8.12 | R68.1 26.89,55.35 v26.99,55.24 | v38.79,19.81 38.16,20.43 | C15.2 121.98,20.43 v122.61,19.81
  Top 0.61: SW1.B v160.61,70.76 SW1.B' | J3.3 J3.5 v153.02,80.61 | J3.9 v153.02,83.15 | MOD1.1 119.53,74.08 v119.68,73.94 | MOD1.35 136.64,73.94 v134.6,73.94 | SW2.B v93.47,7.38 SW2.B' | SW3.B v93.47,31.52 SW3.B' | SW4.B v93.47,19.45 SW4.B' | SW5.B v93.47,43.58 SW5.B' | SW6.B v93.47,55.65 SW6.B' | SW7.B v93.47,67.71 SW7.B' | SW8.B v76.79,70.76 SW8.B' | J5.3 J5.5 v69.2,80.61 | J5.9 v69.2,83.15 | MOD2.1 35.71,74.08 v35.86,73.94 | MOD2.35 52.82,73.94 v50.78,73.94 | SW9.B v9.65,7.38 SW9.B' | SW10.B v9.65,31.52 SW10.B' | SW11.B v9.65,19.45 SW11.B' | SW12.B v9.65,43.58 SW12.B' | SW13.B v9.65,55.65 SW13.B' | SW14.B v9.65,67.71 SW14.B'
  Top 0.686: IC1.2 v146.53,41.27 | 146.18,58.84 v145.26,59.69 | IC4.2 v62.71,41.27 | 62.36,58.84 v61.44,59.69
  Top 0.711: IC1.2 149.6,41.27 149.6,38.72 C1.2 149.29,38.72 149.29,36.73 v149.07,36.51 | v145.26,41.29 145.26,41.26 C2.2 143.99,41.26 v143.99,42.54 143.99,46.4 X1.2 146.14,48.55 C6.2 146.18,53.18 IC2.2 146.18,58.84 146.18,59.62 arc-90 146.49,59.92 | C22.2 v153.99,32.86 | C22.2 152.62,33.92 v152.56,33.97 | C22.2 v152.62,31.65 152.56,31.59 | IC4.2 65.78,41.27 65.78,38.72 C34.2 65.47,38.72 65.47,36.73 v65.25,36.51 | v61.44,41.29 61.44,41.26 C35.2 60.17,41.26 v60.17,42.54 60.17,46.4 X4.2 62.32,48.55 C33.2 62.36,53.18 IC6.2 62.36,58.84 62.36,59.62 arc-90 62.67,59.92 | C51.2 v70.17,32.86 | C51.2 68.8,33.92 v68.74,33.97 | C51.2 v68.8,31.65 68.74,31.59
  Bottom 0.152: 126.36,23.02 v126.44,23.02 127,23.02 | 126.52,23.26 126.44,23.26 | C25.2 125.12,31.35 GND.5 | GND.11 125.61,35.25 125.37,35.48 | GND.16 133.31,33.95 133.35,33.98 | 42.55,23.02 v42.62,23.02 43.18,23.02 | 42.7,23.26 42.62,23.26 | C52.2 41.3,31.35 GND52.5 | GND52.11 41.79,35.25 41.55,35.48 | GND52.16 49.49,33.95 49.53,33.98
  Bottom 0.406: J1.SHELL 138.78,19.02 v138.91,18.89 | J1.SHELL3 137.06,11.27 v138.91,11.27 | J1.SHELL2 137.32,13.82 | 137.32,13.82 v138.9,13.82 v138.91,13.81 | J1.SHELL1 136.94,16.35 v138.91,16.35 | 137.22,13.72 137.32,13.82 | J1.5 133.1,13.72 133.03,13.65 v133.03,12.7 | 124.48,18.77 124.48,18.82 124.46,18.85 124.65,18.85 C8.2 126.39,19.06 126.39,19.07 | J6.SHELL 54.96,19.02 v55.09,18.89 | J6.SHELL3 53.24,11.27 v55.09,11.27 | J6.SHELL2 53.5,13.82 | 53.5,13.82 v55.08,13.82 v55.09,13.81 | J6.SHELL1 53.12,16.35 v55.09,16.35 | 53.4,13.72 53.5,13.82 | J6.5 49.28,13.72 49.21,13.65 v49.21,12.7 | 40.66,18.77 40.66,18.82 40.64,18.85 40.83,18.85 C37.2 42.57,19.06 42.57,19.07
  other vias: 146.53,42.54 145.26,42.54 146.53,43.81 145.26,43.81 143.99,43.81 141.45,59.69 141.45,61.59 141.45,63.5 141.45,65.41 143.35,59.69 143.35,61.59 143.35,63.5 143.35,65.41 145.26,63.5 145.26,65.41 147.16,63.5 147.16,65.41 149.07,65.41 149.07,63.5 150.97,65.41 150.97,63.5 150.97,61.59 149.07,61.59 149.07,59.69 147.16,59.69 149.64,41.27 152.88,61.59 152.88,63.5 152.88,65.41 127.48,16.11 125.81,16.11 125.81,17.07 124.94,17.07 124.94,16.11 124.94,15.16 129.78,13.26 130.96,34.9 119.02,22.86 125.12,35.89 120.98,34.65 62.71,42.54 61.44,42.54 62.71,43.81 61.44,43.81 60.17,43.81 57.63,59.69 57.63,61.59 57.63,63.5 57.63,65.41 59.53,59.69 59.53,61.59 59.53,63.5 59.53,65.41 61.44,63.5 61.44,65.41 63.34,63.5 63.34,65.41 65.25,65.41 65.25,63.5 67.15,65.41 67.15,63.5 67.15,61.59 65.25,61.59 65.25,59.69 63.34,59.69 65.82,41.27 69.06,61.59 69.06,63.5 69.06,65.41 43.66,16.11 41.99,16.11 41.99,17.07 41.12,17.07 41.12,16.11 41.12,15.16 45.96,13.26 47.14,34.9 35.2,22.86 41.3,35.89 37.16,34.65
  pour Top: 143.36,44.44 147.17,44.44 147.17,40.95 143.36,40.95
  pour Top (no thermals): 154.15,66.99 154.15,60.01 148.75,60.01 148.75,58.42 140.18,58.42 140.18,66.99
  pour Top (isolate 1.016): 154.15,60.01 148.75,60.01 148.75,58.42 154.15,58.42
  pour Bottom: 124.62,20.24 125.41,20.24 125.41,21.03 124.62,21.03
  pour Top (isolate 0.229): 92.71,87.63 163.83,87.63 163.83,1.27 92.71,1.27
  pour Bottom (isolate 0.127): 85.09,87.63 163.83,87.63 163.83,1.27 85.09,1.27
  pour Top: 59.54,44.44 63.35,44.44 63.35,40.95 59.54,40.95
  pour Top (no thermals): 70.33,66.99 70.33,60.01 64.93,60.01 64.93,58.42 56.36,58.42 56.36,66.99
  pour Top (isolate 1.016): 70.33,60.01 64.93,60.01 64.93,58.42 70.33,58.42
  pour Bottom: 40.8,20.24 41.59,20.24 41.59,21.03 40.8,21.03
  pour Top (isolate 0.229): 8.89,87.63 80.01,87.63 80.01,1.27 8.89,1.27
  pour Bottom (isolate 0.127): 1.27,87.63 80.01,87.63 80.01,1.27 1.27,1.27
IN  (via drill 0.35)  (1 unrouted)
  Top 0.152: D1.1 116.84,28.42 117.79,29.37 v117.79,31.91 | v117.79,33.18 117.79,38.26 118.11,38.58 124.62,38.58 125.53,37.67 125.84,37.67 v127.52,37.66 | v134.53,35.62 134.62,35.56 134.62,36.99 134.15,37.46 v132.72,37.46 132.72,38.73 134.11,40.13 134.11,52.58 138.18,56.64 138.18,59.69 137.78,60.08 MOD1.25 135.68,60.08 135.66,60.07 135.18,60.55 135.18,61.77 135.61,62.2 138.51,62.2 139.22,61.49 139.22,56.16 135.53,52.48 135.53,42.11 136.5,41.15 136.5,31.27 133.96,28.73 v133.4,28.73 | D2.1 33.02,28.42 33.97,29.37 v33.97,31.91 | v33.97,33.18 33.97,38.26 34.29,38.58 40.8,38.58 41.71,37.67 42.02,37.67 v43.7,37.66 | v50.7,35.62 50.8,35.56 50.8,36.99 50.33,37.46 v48.9,37.46 48.9,38.73 50.29,40.13 50.29,52.58 54.36,56.64 54.36,59.69 53.96,60.08 MOD2.25 51.85,60.08 51.84,60.07 51.36,60.55 51.36,61.77 51.79,62.2 54.69,62.2 55.4,61.49 55.4,56.16 51.71,52.48 51.71,42.11 52.68,41.15 52.68,31.27 50.14,28.73 v49.58,28.73
  Bottom 0.152: v117.79,31.91 v117.79,33.18 | v132.72,37.46 v132.72,37.47 v132.71,37.46 131.87,37.49 131.5,37.87 131.5,41.3 130.96,41.83 128.45,41.83 127.97,41.35 127.97,38.11 v127.52,37.66 | GND.14 132.51,35.24 134.15,35.24 v134.53,35.62 | GND.24 133.38,28.75 v133.4,28.73 | v33.97,31.91 v33.97,33.18 | v48.9,37.46 v48.9,37.47 v48.89,37.46 48.05,37.49 47.68,37.87 47.68,41.3 47.14,41.83 44.63,41.83 44.15,41.35 44.15,38.11 v43.7,37.66 | GND52.14 48.69,35.24 50.33,35.24 v50.7,35.62 | GND52.24 49.56,28.75 v49.58,28.73
LED0  (via drill 0.35)  (1 unrouted)
  Top 0.254: LED1.C 118.58,77.71 v126.62,69.67 | MOD1.29 136.74,65.72 130.52,65.72 v127.86,68.38 | LED3.C 34.76,77.71 v42.8,69.67 | MOD2.29 52.92,65.72 46.7,65.72 v44.04,68.38
  Bottom 0.254: v127.86,68.38 126.62,69.62 v126.62,69.67 | v44.04,68.38 42.8,69.62 v42.8,69.67
LED1  (via drill 0.35)  (1 unrouted)
  Top 0.254: LED2.C 99.68,81.19 116.5,81.19 v127.31,70.38 | v128.53,69.08 130.53,67.08 MOD1.30 | LED4.C 15.86,81.19 32.68,81.19 v43.48,70.38 | v44.71,69.08 46.71,67.08 MOD2.30
  Bottom 0.254: v128.53,69.08 127.31,70.31 v127.31,70.38 | v44.71,69.08 43.48,70.31 v43.48,70.38
N$1
  Top 0.406: R1.1 151.16,43.74 151.16,42.22 | 151.16,42.19 151.16,42.22 | 151.16,42.22 IC1.5
N$2
  Top 0.406: R2.2 153.19,45.8 152.71,46.33 R3.2
N$3
  Top 0.406: IC1.1 148.42,45.85 148.9,46.33 R3.1
N$5  (via drill 0.3)
  Top 0.406: R36.2 135.25,7.91 | 135.25,7.91 v135.25,8.89 | R37.1 135.25,6.42 135.25,7.91
  Bottom 0.406: J1.4 135.02,14.37 135.25,14.13 v135.25,8.89
N$8
  Top 0.152: R38.2 115.32,18.8 114.2,19.91 114.2,29.06 114.71,29.57 114.71,29.97 114.68,30 114.92,30 D1.2
N$9  (via drill 0.35)
  Top 0.152: v135.82,34.62 135.81,34.56 135.81,40.11 v135.38,40.54 | v133.5,40.54 131.39,40.54 131.26,40.68 IC5.19
  Bottom 0.152: v135.38,40.54 v133.5,40.54 | v135.82,34.62 135.8,34.6 GND.15
N$10
  Top 0.406: R39.1 67.33,43.74 67.33,42.22 | 67.33,42.19 67.33,42.22 | 67.33,42.22 IC4.5
N$11
  Top 0.406: R40.2 69.37,45.8 68.89,46.33 R41.2
N$12
  Top 0.406: IC4.1 64.6,45.85 65.08,46.33 R41.1
N$27
  Top 0.152: R4.2 122.7,21.75 123.11,21.75 123.27,21.59 123.27,20.65 C15.1 123.28,19.59 123.55,19.32 IC3.18
N$28
  Top 0.152: R5.1 122.32,13.34 123.07,14.09 IC3.27
N$31  (via drill 0.3)
  Top 0.152: IC3.35 127.31,13.26 v127.64,12.94
  Bottom 0.152: v127.64,12.94 127.64,12.32 arc90 R6.1
N$34  (via drill 0.3, 0.35)
  Top 0.406: v134.62,20.5 145.56,31.43 v147.96,31.43
  Top 0.711: R8.2 v147.96,31.43
  Bottom 0.406: J1.1 135.06,16.32 135.25,16.51 135.25,17.78 134.62,18.41 v134.62,20.5
N$35
  Top 0.152: 125.48,11.11 R7.2 125.56,11.03 | 125.48,11.11 125.48,11.65 125.81,11.99 IC3.32 | 125.02,7.38 124.92,7.38 Y1.1 124.56,6.93 125.57,7.94 125.57,9.92 | 125.57,9.92 125.57,11.02 125.56,11.03 | 125.56,11.03 125.48,11.11 | C20.2 125.57,9.92
N$36
  Top 0.152: IC3.33 126.31,11.96 126.6,11.67 126.6,11.21 R7.1 arc90 126.67,10.93 126.67,9.92 | 126.67,9.92 Y1.3 | C21.1 126.67,9.92
  Top 0.254: 126.55,8.83 Y1.3
N$37
  Top 0.711: R8.1 150.87,32.81 C22.1 150.91,34.29 R9.2
N$38  (via drill 0.35)
  Top 0.152: J2.5 123.79,33.55 124.54,34.3 v125.17,34.3
  Bottom 0.152: v125.17,34.3 125.28,34.3 125.64,33.95 GND.9
N$39
  Top 0.152: R18.2 126.78,39.85 127.16,39.85 127.36,40.04 IC5.13
N$40
  Top 0.254: IC5.11 125.98,41.27 C26.1 R19.1
N$41  (via drill 0.35)
  Top 0.152: v133.37,33.27 131.51,33.27 129.78,35 129.78,40.08 129.31,40.56 IC5.16
  Bottom 0.152: v133.37,33.27 132.17,33.27 GND.17
N$42  (via drill 0.35)
  Top 0.152: v133.37,32.47 133.23,32.61 131.77,32.61 131.41,32.97 131.39,32.97 128.91,35.45 128.91,40.48 128.66,40.73 IC5.15
  Bottom 0.152: v133.37,32.47 133.19,32.65 GND.18
N$43  (via drill 0.35)
  Top 0.152: J2.1 124.71,29.15 v124.78,29.21
  Bottom 0.152: v124.78,29.21 125.41,29.84 125.41,30.48 125.63,30.7 GND.4
N$44  (via drill 0.35)
  Top 0.152: v126.28,36.6 123.09,36.63 J2.8
  Bottom 0.152: GND.12 126.28,36.55 v126.28,36.6
N$45  (via drill 0.35)
  Top 0.152: J2.2 126.13,30.25 v127.48,31.59
  Bottom 0.152: v127.48,31.59 127.07,32 GND.6
N$46
  Top 0.152: T1.3 107.5,28.42 108.43,28.42 109,28.99 T2.1 106.86,29.5 106.36,30 106.36,31.59 106.84,32.07 R17.1
N$48
  Top 0.61: R20.2 152.89,68.36 R11.2 156.38,68.35 156.61,68.12 SW1.A' SW1.A
N$49
  Top 0.152: R10.1 111.03,27 T2.3 111.03,29.11 111.28,29.37 D1.3
N$50
  Top 0.61: J3.4 143.17,79.34 141.27,77.43 141.27,74.89 139.05,72.67 139.03,72.68 MOD1.34
N$51  (via drill 0.3)
  other vias: 125.41,21.75
N$52
  Top 0.61: MOD1.31 147.56,68.48 149.21,70.13 151.16,70.13 | 151.16,70.13 R20.1 | J3.10 146.67,83.19 146.67,84.1 147.3,84.73 153.65,84.73 154.6,83.78 154.6,78.7 151.11,75.21 151.11,70.18 151.16,70.13
N$53
  Top 0.61: J3.2 143.81,78.07 142.86,77.11 142.86,74.57 139.57,71.28 MOD1.33
N$54
  Top 0.254: R27.1 LED1.A
N$55
  Top 0.254: C23.1 R31.1 115.07,61.42 115.89,62.23 115.89,62.55 116.2,62.87 117.16,62.87 MOD1.9
N$56
  Top 0.254: C28.1 109.22,52.07 108.74,52.55 X3.2
N$57
  Top 0.254: C29.1 109.22,49.21 108.9,48.9 107.57,48.9 X3.1
N$58
  Top 0.406: C29.2 115.89,49.21 | 115.89,49.21 R33.2 | C24.2 115.89,49.21
N$59
  Top 0.406: C28.2 115.89,52.07 | 115.89,52.07 R32.2 | C24.1 115.89,52.07
N$61
  Top 0.254: R28.1 LED2.A
N$63
  Top 0.406: X2.1 104.94,57.05 R30.2 R29.2
N$64
  Top 0.406: MOD1.8 112.25,64.28 112.01,64.52 T3.3
N$65
  Top 0.406: R29.1 109.54,62.46 T3.1
N$66
  Top 0.152: R42.2 38.88,21.75 39.29,21.75 39.45,21.59 39.45,20.65 C44.1 39.46,19.59 39.73,19.32 IC7.18
N$70
  Top 0.152: R43.1 38.5,13.34 39.25,14.09 IC7.27
N$73  (via drill 0.3)
  Top 0.152: IC7.35 43.49,13.26 v43.81,12.94
  Bottom 0.152: v43.81,12.94 43.81,12.32 arc90 R44.1
N$74
  Top 0.152: 41.66,11.11 R45.2 41.74,11.03 | 41.66,11.11 41.66,11.65 41.99,11.99 IC7.32 | 41.2,7.38 41.1,7.38 Y2.1 40.74,6.93 41.75,7.94 41.75,9.92 | 41.75,9.92 41.75,11.02 41.74,11.03 | 41.74,11.03 41.66,11.11 | C49.2 41.75,9.92
N$75
  Top 0.152: IC7.33 42.49,11.96 42.78,11.67 42.78,11.21 R45.1 arc90 42.85,10.93 42.85,9.92 | 42.85,9.92 Y2.3 | C50.1 42.85,9.92
  Top 0.254: 42.73,8.83 Y2.3
N$76  (via drill 0.3, 0.35)
  Top 0.406: v50.8,20.5 61.73,31.43 v64.14,31.43
  Top 0.711: R46.2 v64.14,31.43
  Bottom 0.406: J6.1 51.24,16.32 51.44,16.51 51.44,17.78 50.8,18.41 v50.8,20.5
N$77
  Top 0.711: R46.1 67.05,32.81 C51.1 67.09,34.29 R47.2
N$78  (via drill 0.3)
  Top 0.406: R74.2 51.44,7.91 | 51.44,7.91 v51.44,8.89 | R75.1 51.44,6.42 51.44,7.91
  Bottom 0.406: J6.4 51.2,14.37 51.44,14.13 v51.44,8.89
N$79  (via drill 0.35)
  Top 0.152: J4.5 39.97,33.55 40.72,34.3 v41.34,34.3
  Bottom 0.152: v41.34,34.3 41.46,34.3 41.81,33.95 GND52.9
N$80
  Top 0.152: R54.2 42.97,39.85 43.34,39.85 43.54,40.04 IC8.13
N$81
  Top 0.254: IC8.11 42.16,41.27 C53.1 R55.1
N$82  (via drill 0.35)
  Top 0.152: v49.55,33.27 47.7,33.27 45.96,35 45.96,40.08 45.49,40.56 IC8.16
  Bottom 0.152: v49.55,33.27 48.35,33.27 GND52.17
N$83  (via drill 0.35)
  Top 0.152: v49.55,32.47 49.41,32.61 47.95,32.61 47.59,32.97 47.57,32.97 45.09,35.45 45.09,40.48 44.84,40.73 IC8.15
  Bottom 0.152: v49.55,32.47 49.37,32.65 GND52.18
N$84  (via drill 0.35)
  Top 0.152: J4.2 42.31,30.25 v43.66,31.59
  Bottom 0.152: v43.66,31.59 43.25,32 GND52.6
N$85  (via drill 0.35)
  Top 0.152: J4.1 40.89,29.15 v40.96,29.21
  Bottom 0.152: v40.96,29.21 41.59,29.84 41.59,30.48 41.81,30.7 GND52.4
N$86  (via drill 0.35)
  Top 0.152: v42.46,36.6 39.27,36.63 J4.8
  Bottom 0.152: GND52.12 42.46,36.55 v42.46,36.6
N$87
  Top 0.152: T4.3 23.68,28.42 24.61,28.42 25.18,28.99 T5.1 23.04,29.5 22.54,30 22.54,31.59 23.02,32.07 R53.1
N$89
  Top 0.152: R56.1 27.21,27 T5.3 27.21,29.11 27.46,29.37 D2.3
N$90
  Top 0.254: C57.1 25.4,52.07 24.92,52.55 X6.2
N$91
  Top 0.254: C58.1 25.4,49.21 25.08,48.9 23.75,48.9 X6.1
N$92
  Top 0.406: C58.2 32.07,49.21 | 32.07,49.21 R71.2 | C56.2 32.07,49.21
N$93
  Top 0.406: C57.2 32.07,52.07 | 32.07,52.07 R70.2 | C56.1 32.07,52.07
N$94
  Top 0.152: R76.2 31.5,18.8 30.38,19.91 30.38,29.06 30.89,29.57 30.89,29.97 30.86,30 31.1,30 D2.2
N$95  (via drill 0.35)
  Top 0.152: v52,34.62 51.99,34.56 51.99,40.11 v51.56,40.54 | v49.68,40.54 47.57,40.54 47.44,40.68 IC8.19
  Bottom 0.152: v51.56,40.54 v49.68,40.54 | v52,34.62 51.98,34.6 GND52.15
N$96
  Top 0.61: R58.2 69.07,68.36 R57.2 72.56,68.35 72.79,68.12 SW8.A' SW8.A
N$97
  Top 0.61: MOD2.31 63.74,68.48 65.39,70.13 67.34,70.13 | 67.34,70.13 R58.1 | J5.10 62.85,83.19 62.85,84.1 63.48,84.73 69.83,84.73 70.78,83.78 70.78,78.7 67.29,75.21 67.29,70.18 67.34,70.13
N$98
  Top 0.61: J5.2 59.99,78.07 59.04,77.11 59.04,74.57 55.75,71.28 MOD2.33
N$99
  Top 0.61: J5.4 59.35,79.34 57.45,77.43 57.45,74.89 55.23,72.67 55.21,72.68 MOD2.34
N$100
  Top 0.254: R65.1 LED3.A
N$101
  Top 0.254: R66.1 LED4.A
N$102
  Top 0.406: MOD2.8 28.43,64.28 28.19,64.52 T6.3
N$103
  Top 0.406: X5.1 21.11,57.05 R68.2 R67.2
N$104
  Top 0.406: R67.1 25.72,62.46 T6.1
N$105
  Top 0.254: C55.1 R69.1 31.25,61.42 32.07,62.23 32.07,62.55 32.38,62.87 33.34,62.87 MOD2.9
N$108  (via drill 0.3)
  other vias: 41.59,21.75
NCD  (1 unrouted)
  Top 0.152: R13.2 R12.1 IC3.26 | R49.2 R48.1 IC7.26
NCD1
  Top 0.152: T1.1 105.35,31.69 106.84,33.18 109,33.18 R16.1 109.22,33.39 109.22,34.29 109.38,34.45 111.92,34.45 113.82,32.54 122.58,32.54 J2.4
NCD2
  Top 0.152: T4.1 21.53,31.69 23.02,33.18 25.18,33.18 R52.1 25.4,33.39 25.4,34.29 25.56,34.45 28.1,34.45 30,32.54 38.76,32.54 J4.4
NEXT  (1 unrouted)
  Top 0.152: IC5.20 131.91,42.98 133.32,44.4 133.32,52.53 132.77,53.09 132.77,56.4 MOD1.22 | IC8.20 48.09,42.98 49.51,44.4 49.51,52.53 48.95,53.09 48.95,56.4 MOD2.22
PLAY  (1 unrouted)
  Top 0.152: 121.56,57.35 MOD1.14 121.38,54.63 122.78,53.24 127.61,53.24 129.31,51.54 IC5.5 | 37.74,57.35 MOD2.14 37.56,54.63 38.96,53.24 43.79,53.24 45.49,51.54 IC8.5
PREV  (1 unrouted)
  Top 0.152: MOD1.20 129.78,53.63 131.91,51.51 IC5.1 | MOD2.20 45.96,53.63 48.09,51.51 IC8.1
PWM  (via drill 0.35)
  Top 0.254: C26.2 R19.2 v120.65,42.86 | v120.65,45.72 123.93,49 IC5.10
  Bottom 0.254: v120.65,42.86 v120.65,45.72
PWM1  (via drill 0.35)
  Top 0.254: C53.2 R55.2 v36.83,42.86 | v36.83,45.72 40.11,49 IC8.10
  Bottom 0.254: v36.83,42.86 v36.83,45.72
PWR  (1 unrouted)
  Top 0.152: 123.07,17.62 arc-90 IC3.21 122.36,17.59 121.97,17.98 121.97,18.67 arc90 R38.1 | 39.25,17.62 arc-90 IC7.21 38.55,17.59 38.15,17.98 38.15,18.67 arc90 R76.1
RESET  (1 unrouted)
  Top 0.152: MOD1.21 131.18,53.02 132.79,51.41 132.79,44.6 132.16,43.97 130.74,43.97 129.96,43.18 IC5.17 | MOD2.21 47.36,53.02 48.97,51.41 48.97,44.6 48.34,43.97 46.92,43.97 46.14,43.18 IC8.17
SDCS  (via drill 0.35)
  Top 0.152: 131.08,35.96 v131.06,35.94 131.06,39.12 130.61,39.57 IC5.18
  Bottom 0.152: v131.06,35.94 131.1,35.9 GND.13
SDCS1  (via drill 0.35)
  Top 0.152: 47.26,35.96 v47.24,35.94 47.24,39.12 46.79,39.57 IC8.18
  Bottom 0.152: v47.24,35.94 47.28,35.9 GND52.13
SDDI  (via drill 0.35)
  Top 0.152: J2.3 123.74,31.35 123.98,31.59 123.98,32.37 v123.92,32.44
  Bottom 0.152: v123.92,32.44 125.5,32.44 125.71,32.65 GND.7
SDDI1  (via drill 0.35)
  Top 0.152: J4.3 39.92,31.35 40.16,31.59 40.16,32.37 v40.1,32.44
  Bottom 0.152: v40.1,32.44 41.67,32.44 41.89,32.65 GND52.7
SDDO  (via drill 0.35)
  Top 0.152: J2.7 123.78,35.75 v124.53,35
  Bottom 0.152: v124.53,35 124.96,35 125.11,34.86 125.39,34.86 125.65,34.6 GND.10
SDDO1  (via drill 0.35)
  Top 0.152: J4.7 39.97,35.75 v40.71,35
  Bottom 0.152: v40.71,35 41.14,35 41.29,34.86 41.57,34.86 41.83,34.6 GND52.10
SPK+
  Top 0.406: IC5.7 127.91,49.1 127.91,50.04 127.15,50.8 121.6,50.8 120.33,52.07 R32.1
SPK+1
  Top 0.406: IC8.7 44.09,49.1 44.09,50.04 43.33,50.8 37.78,50.8 36.51,52.07 R70.1
SPK-
  Top 0.406: R33.1 120.65,49.21 121.6,50.16 127,50.16 127.36,49.81 IC5.8
SPK-1
  Top 0.406: R71.1 36.83,49.21 37.78,50.16 43.18,50.16 43.54,49.81 IC8.8
TASTE0  (1 unrouted)
  Top 0.254: MOD1.7 102.2,65.68 101.6,65.09 101.6,60.01 100.65,59.05 100.65,13.97 100.01,13.34 97.91,13.34 97.59,13.02 | MOD2.7 18.38,65.68 17.78,65.09 17.78,60.01 16.83,59.05 16.83,13.97 16.19,13.34 14.09,13.34 13.77,13.02
  Top 0.61: SW2.A SW2.A' 97.59,10.9 97.59,13.02 R21.1 | SW9.A SW9.A' 13.77,10.9 13.77,13.02 R59.1
TASTE1  (1 unrouted)
  Top 0.254: MOD1.5 101.19,68.48 100.33,67.63 100.33,60.64 99.38,59.69 99.38,38.1 98.74,37.47 97.67,37.47 R22.1 97.59,35.03 SW3.A' | MOD2.5 17.37,68.48 16.51,67.63 16.51,60.64 15.56,59.69 15.56,38.1 14.92,37.47 13.86,37.47 R60.1 13.77,35.03 SW10.A'
  Top 0.61: SW3.A SW3.A' | SW10.A SW10.A'
TASTE2  (1 unrouted)
  Top 0.254: MOD1.6 102.01,67.08 100.97,66.04 100.97,60.33 100.01,59.37 100.01,26.67 98.74,25.4 97.67,25.4 R23.1 | MOD2.6 18.19,67.08 17.14,66.04 17.14,60.33 16.19,59.37 16.19,26.67 14.92,25.4 13.86,25.4 R61.1
  Top 0.61: SW4.A SW4.A' 97.59,22.97 R23.1 | SW11.A SW11.A' 13.77,22.97 R61.1
TASTE3  (1 unrouted)
  Top 0.254: MOD1.4 100.68,69.88 99.69,68.9 99.69,60.96 98.74,60.01 98.74,49.85 98.42,49.53 98.34,49.61 R24.1 | MOD2.4 16.86,69.88 15.88,68.9 15.88,60.96 14.92,60.01 14.92,49.85 14.61,49.53 14.52,49.61 R62.1
  Top 0.61: SW5.A 97.47,44.22 | 97.47,44.22 97.47,46.76 | 97.47,46.76 SW5.A' | R24.1 97.59,46.88 97.47,46.76 | 97.55,44.29 97.47,44.22 | SW12.A 13.65,44.22 | 13.65,44.22 13.65,46.76 | 13.65,46.76 SW12.A' | R62.1 13.77,46.88 13.65,46.76 | 13.72,44.29 13.65,44.22
TASTE4  (1 unrouted)
  Top 0.254: MOD1.3 99.86,71.28 99.06,70.48 99.06,62.23 98.42,61.59 97.59,61.59 | MOD2.3 16.04,71.28 15.24,70.48 15.24,62.23 14.61,61.59 13.77,61.59
  Top 0.61: R25.1 97.59,61.59 97.59,59.16 SW6.A' SW6.A 97.54,52.18 97.54,51.36 97.74,51.56 | 117.07,71.4 MOD1.3 | R63.1 13.77,61.59 13.77,59.16 SW13.A' SW13.A 13.72,52.18 13.72,51.36 13.92,51.56 | 33.25,71.4 MOD2.3
TASTE5  (1 unrouted)
  Top 0.254: MOD1.2 100.04,72.68 99.06,73.66 97.67,73.66 R26.1 | MOD2.2 16.22,72.68 15.24,73.66 13.86,73.66 R64.1
  Top 0.61: SW7.A 97.47,70.89 | 97.47,70.89 SW7.A' | R26.1 97.59,71 97.47,70.89 | SW14.A 13.65,70.89 | 13.65,70.89 SW14.A' | R64.1 13.77,71 13.65,70.89
V+  (via drill 0.35)  (1 unrouted)
  Top 0.254: R31.2 115.18,59.72 116.23,60.77 118.75,60.77 119.14,60.38 v125.75,60.38 | v127.79,60.45 132.1,60.45 135.23,63.58 135.24,63.57 137.73,63.57 139.98,61.32 139.98,57.68 142.09,55.57 X1.1 | R69.2 31.36,59.72 32.41,60.77 34.92,60.77 35.32,60.38 v41.94,60.38 | v43.97,60.45 48.28,60.45 51.41,63.58 51.42,63.57 53.91,63.57 56.16,61.32 56.16,57.68 58.27,55.57 X4.1
  Top 0.711: 142.12,47.99 C2.1 142.08,41.22 142.08,40.01 142.72,39.37 145.89,39.37 146.84,40.32 IC1.3 | 142.12,47.99 X1.1 | 142.12,47.99 144.24,50.12 C6.1 144.24,53.46 arc90 144,53.7 144,54.63 arc-90 143.87,54.76 IC2.1 | 58.3,47.99 C35.1 58.26,41.22 58.26,40.01 58.9,39.37 62.07,39.37 63.02,40.32 IC4.3 | 58.3,47.99 X4.1 | 58.3,47.99 60.42,50.12 C33.1 60.42,53.46 arc90 60.18,53.7 60.18,54.63 arc-90 60.05,54.76 IC6.1
  Bottom 0.254: v127.79,60.45 125.83,60.45 v125.75,60.38 | v43.97,60.45 42.01,60.45 v41.94,60.38
  other vias: 142.4,37.62 144.46,37.62 146.53,37.62 142.4,35.56 144.46,35.56 146.53,35.56 146.53,33.5 144.46,33.5 142.4,33.5 58.58,37.62 60.64,37.62 62.71,37.62 58.58,35.56 60.64,35.56 62.71,35.56 62.71,33.5 60.64,33.5 58.58,33.5
  pour Top (no thermals): 141.6,40.01 148.19,40.01 148.19,32.62 141.6,32.62
  pour Top (no thermals): 57.78,40.01 64.37,40.01 64.37,32.62 57.78,32.62
VDD18  (1 unrouted)
  Top 0.152: IC3.13 126.31,20.65 C14.1 C13.1 | IC7.13 42.49,20.65 C43.1 C42.1
VDD18PLL  (1 unrouted)
  Top 0.152: IC3.34 126.81,12.73 127.32,12.22 C18.1 C19.1 | IC7.34 42.99,12.73 43.5,12.22 C47.1 C48.1
WP  (1 unrouted)
  Top 0.152: R14.1 R15.2 119.44,12.03 124.17,12.03 124.81,12.67 IC3.30 | R50.1 R51.2 35.62,12.03 40.35,12.03 40.99,12.67 IC7.30

## Text on the board
Top: P0 | P0 | P1 | P1 | S6 | S6 | S5 | S5 | S4 | S4 | S3 | S3 | S2 | S2 | S1 | S1 | FHNW Pro4E 18 / Team3 / Prototyp 1.0 / Top Layer | FHNW Pro4E 18 / Team3 / Prototyp 1.0 / Top Layer
Bottom: FHNW Pro4E 18 / Team3 / Prototyp 1.0 Layer / Bottom Layer | FHNW Pro4E 18 / Team3 / Prototyp 1.0 Layer / Bottom Layer